# Altium schematic sheet MAIN_LORA_ANT.SchDoc
size A3; DocumentNumber: 1; SheetNumber: 1; SheetTotal: 2
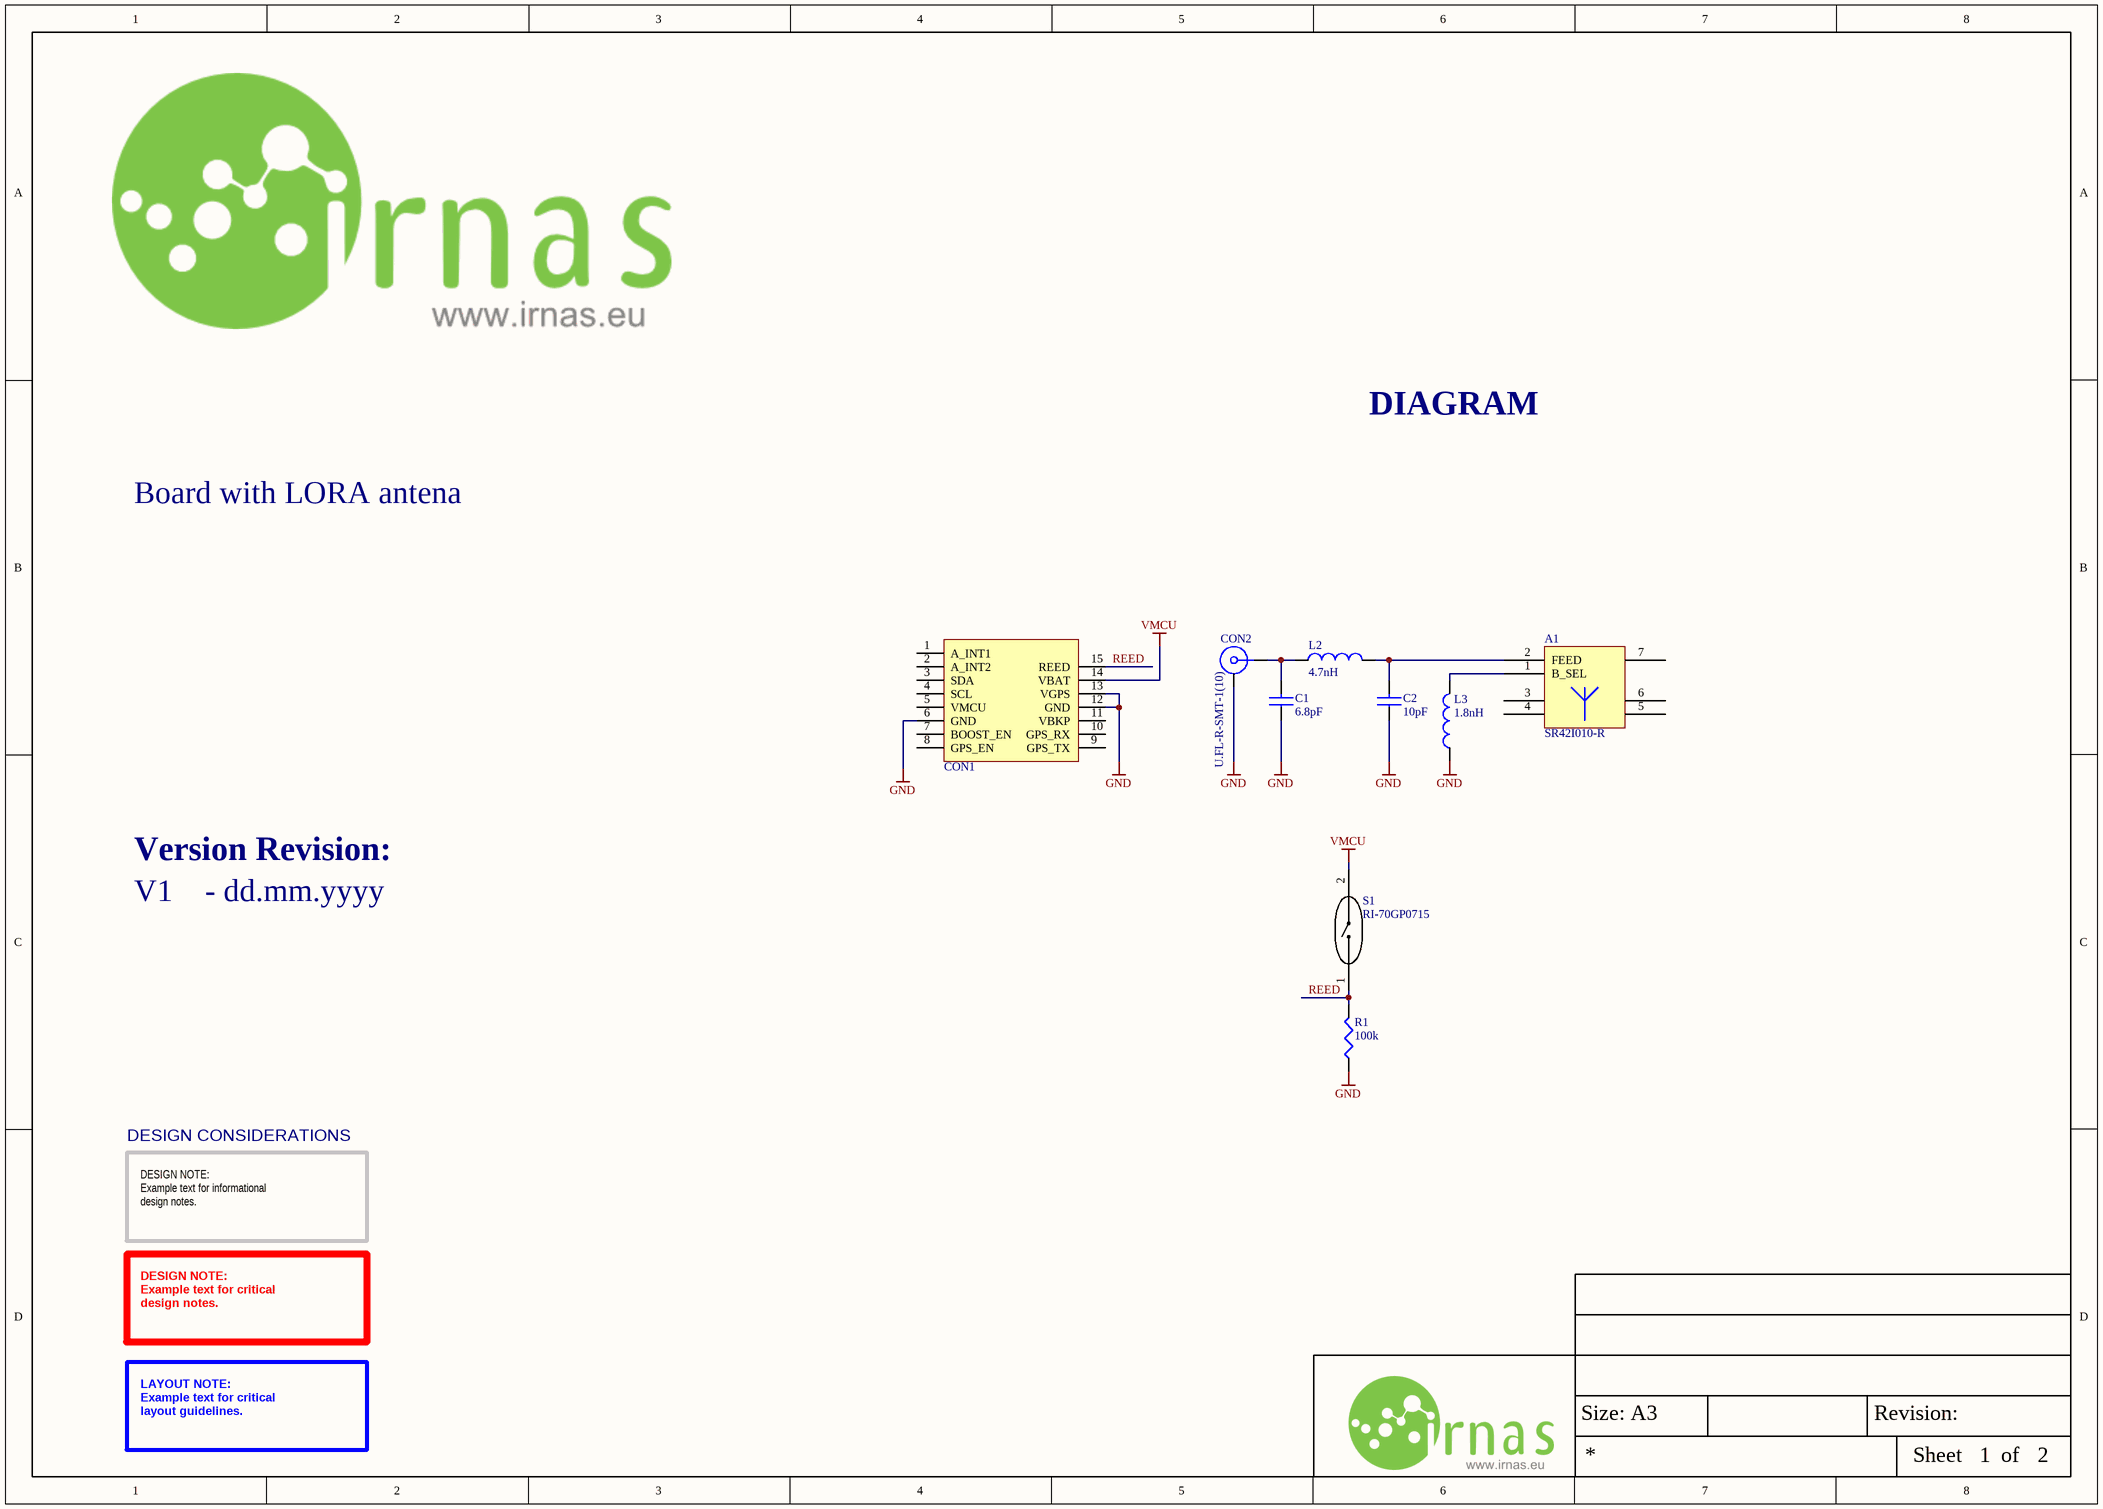
[diagram p0: MAIN_LORA_ANT.SchDoc]

## Parts
A1  SR42I010-R  [LORA_PCB_ANTENNA]
C1  6.8pF  [CAP0402]
C2  10pF  [CAP0402]
CON1  Between PCB connection  [SmartParks_Rhino]  (value not drawn)
CON2  U.FL-R-SMT-1(10)  [ufl connector smd]
L2  4.7nH  [IND0402]
L3  1.8nH  [IND0402]
R1  100k  [RES0402]
S1  RI-70GP0715  [RI-70GP0715]

## Nets
GND: C1.1 C2.1 CON1.6(GND) CON1.12(GND) CON1.13(VGPS) CON2.2 L3.1 R1.1
VMCU: CON1.14(VBAT) S1.2
REED: CON1.15(REED) R1.2 S1.1
NetA1_1: A1.1(B_SEL) L3.2
NetA1_2: A1.2(FEED) C2.2 L2.2
NetC1_2: C1.2 CON2.1 L2.1

Not connected (* = marked no-connect by the designer): A1 3 4 5 6 7; CON1 1(A_INT1) 2(A_INT2) 3(SDA) 4(SCL) 5(VMCU) 7(BOOST_EN) 8(GPS_EN) 9(GPS_TX) 10(GPS_RX) 11(VBKP)

## Notes on the sheet
- DIAGRAM
- Board with LORA antena
- Version Revision:
- V1    - dd.mm.yyyy
- DESIGN CONSIDERATIONS
- DESIGN NOTE:
  Example text for informational
  design notes.
- DESIGN NOTE:
  Example text for critical
  design notes.
- LAYOUT NOTE:
  Example text for critical
  layout guidelines.
- Size: A3
- Revision:
- Sheet
- of

## Library data of the parts
A1 = ANT - SR42I010-R: Antenna SMD -4dBi Gain 870MHz/928MHz Automotive 7-Pin SMD T/R; Manufacturer: Antenova; Supplier 1: Mouser; Manufacturer Part Number: SR42I010-R; Stock 1: 3154; Pricing 1: 1 = 2.36000, 10 = 1.90000, 50 = 1.90000, 100 = 1.52000, 1000 = 1.07000, 10000 = 0.95900 (USD); Supplier Part Number 1: 237-SR42I010-R
C1 C2 = C - 1.8pF/0402: Multilayer Ceramic Capacitors MLCC - SMD/SMT 50volts 1.8pF C0G; Manufacturer: KEMET; Manufacturer Part Number: C0402C189B5GACTU; IRNAS Part No.: /; Voltage Rating: 50V; Stock 1: 8950; Pricing 1: 10=0.463, 100=0.248, 500=0.182, 2500=0.153, 5000=0.134, 10000=0.11, 50000=0.0961 (EUR); Case/Package: 0402; Case Code (Imperial): 0402; Case Code (Metric): 1005; Dielectric Material: Ceramic; Min Operating Temperature: -55°C; Max Operating Temperature: 125°C; Packaging: Tape and Reel; Voltage Rating (DC): 50V; Capacitance: 1.8pF; Termination: SMD/SMT; Lead Free: Lead Free; ComponentLink1URL: https://datasheet.ciiva.com/5413/kem-c1003-c0g-smd-5413366.pdf; ComponentLink1Description: https://datasheet.ciiva.com/5413/kem-c1003-c0g-smd-5413366.pdf; Supplier 1: Farnell
  C1: Supplier Part Number 1: 1414651
  C2: Supplier Part Number 1: 2496789
CON1 = SmartParks_Rhino
CON2 = U.FL-R-SMT-1(10): RF / Coaxial Connector, U.FL Coaxial, Straight Jack, Surface Mount Vertical, 50 ohm, Brass; Manufacturer: Hirose; Featured Product: U.FL Series Connectors; Connector Style: U.FL, Ultra Miniature Coaxial; Connector Type: Receptacle, Male Pin; Contact Termination: Solder; Impedance: 50 Ohm; Frequency - Max: 6GHz; Body Material: Phosphor Bronze; Body Finish: Silver; Center Contact Plating: Gold; Dielectric Material: Liquid Crystal Polymer (LCP); Online Catalog: UMCC (Ultra Miniature Coax Connectors), U.FL Series; Other Names: H11891TR  Q5400621  U.FL-R-SMT-1 10  U.FL-R-SMT-1(10)-ND  UFLRSMT110; Supplier 1: Farnell; Manufacturer Part Number: U.FL-R-SMT-1(10); Stock 1: 0; Standard Package: 2,500; Category: Connectors, Interconnects; Family: Coaxial Connectors (RF); Series: U.FL; Packaging: Tape & Reel (TR); Shield Termination: Solder; Mounting Type: Surface Mount; Cable Group: -; Fastening Type: Snap-On; Features: -; Housing Color: Beige; Ingress Protection: -; Center Contact Material: Brass; Voltage Rating: -; Operating Temperature: -40°C ~ 90°C; ComponentLink1URL: http://www.farnell.com/datasheets/91524.pdf; ComponentLink1Description: http://www.farnell.com/datasheets/91524.pdf; ComponentLink2URL: http://uk.rs-online.com/webdocs/1363/0900766b81363563.pdf; ComponentLink2Description: http://uk.rs-online.com/webdocs/1363/0900766b81363563.pdf; ComponentLink3URL: http://www.farnell.com/datasheets/1947917.pdf; ComponentLink3Description: http://www.farnell.com/datasheets/1947917.pdf; Supplier Part Number 1: 1688077
L2 L3 = L - 4.3nH/0402: Inductor RF Chip Multi-Layer 4.3nH 0.3nH 100MHz 8Q-Factor Air 300mA 210mOhm DCR 0402 Paper T/R; Manufacturer: Murata; Manufacturer Part Number: LQG15HN4N3S02D; IRNAS Part No.: /; Q Factor: 8; Self Resonant Frequency: 6GHz; Shielding: Unshielded; DC Resistance (DCR): 210mR; Stock 1: 3502; Pricing 1: 1 = 0.10000, 10 = 0.06100, 100 = 0.04040, 500 = 0.03366, 1000 = 0.02827, 2500 = 0.02423 (USD); RoHS: Yes; Mount: Surface Mount; Case/Package: 0402; Core Material: Air; Case Code (Metric): 1005; Case Code (Imperial): 0402; Min Operating Temperature: -55°C; Max Operating Temperature: 125°C; Package Quantity: 10000; Packaging: Tape and Reel; Current Rating: 300mA; Inductance: 4.3nh; Test Frequency: 100MHz; Max DC Current: 300mA; Termination: SMD/SMT; Current: 300mA; DC Current: 300mA; Military Standard: Not; Length: 1.05mm; Height: 0.5mm; Width: 0.02inch; Height - Seated (Max): 0.022inch; Depth: 0.55mm; Radiation Hardening: No; REACH SVHC: No SVHC; Lead Free: Lead Free; ComponentLink1URL: http://uk.rs-online.com/webdocs/0f10/0900766b80f10808.pdf?src-supplier=RSComponents; ComponentLink1Description: http://uk.rs-online.com/webdocs/0f10/0900766b80f10808.pdf?src-supplier=RSComponents; ComponentLink2URL: http://search.murata.co.jp/Ceramy/image/img/PDF/ENG/L0075S0083LQG15HN.pdf?src-supplier=Avnet; ComponentLink2Description: http://search.murata.co.jp/Ceramy/image/img/PDF/ENG/L0075S0083LQG15HN.pdf?src-supplier=Avnet; ComponentLink3URL: http://www.farnell.com/datasheets/66026.pdf?src-supplier=Element14; ComponentLink3Description: http://www.farnell.com/datasheets/66026.pdf?src-supplier=Element14; ComponentLink4URL: https://www.verical.com/server-webapp/html/getDatasheet?partID=31252&src-supplier=Verical; ComponentLink4Description: https://www.verical.com/server-webapp/html/getDatasheet?partID=31252&src-supplier=Verical; ComponentLink5URL: http://search.murata.co.jp/Ceramy/image/img/PDF/ENG/L0075S0083LQG15HN.pdf?src-supplier=Avnet+Europe; ComponentLink5Description: http://search.murata.co.jp/Ceramy/image/img/PDF/ENG/L0075S0083LQG15HN.pdf?src-supplier=Avnet+Europe; ComponentLink6URL: https://search.murata.co.jp/Ceramy/image/img/P02/partnumberingAT_LQ3E.pdf?src-supplier=Digi-Key; ComponentLink6Description: https://search.murata.co.jp/Ceramy/image/img/P02/partnumberingAT_LQ3E.pdf?src-supplier=Digi-Key; Supplier 1: Farnell
  L2: Supplier Part Number 1: 1711735
  L3: Supplier Part Number 1: 1669627
R1 = R - 100k/0402: MULTICOMP   MCWR04X1003FTL   RES, THICK FILM, 100KOHM, 1%, 0.0625W; IRNAS Part No.: I-100013; Resistance: 100kR; Power Rating: 62.5mW; Voltage Rating: 50V; Temperature Coefficient: 100ppm/°C; Supplier 1: Farnell; Manufacturer: Multicomp; Manufacturer Part Number: MCWR04X1003FTL; Stock 1: 161188; Pricing 1: 10=0.0029, 100=0.0017, 500=0.0012, 2500=0.001, 5000=0.0008 (EUR); Mount: Surface Mount; Case/Package: 0402; Case Code (Metric): 1005; Case Code (Imperial): 0402; Tolerance: 1%; Packaging: Cut Tape; Composition: Thick Film; Voltage Rating (DC): 50V; REACH SVHC: No SVHC; ComponentLink1URL: https://datasheet.ciiva.com/46386/1849611-46386524.pdf; ComponentLink1Description: https://datasheet.ciiva.com/46386/1849611-46386524.pdf; Supplier Part Number 1: 2447094
S1 = Reed Switch: Supplier 1: Farnell; Supplier Part Number 1: 1081702